# Altium schematic sheet 02-GPRS.SchDoc
size A4; DocumentNumber: 18; SheetNumber: 18; SheetTotal: 34
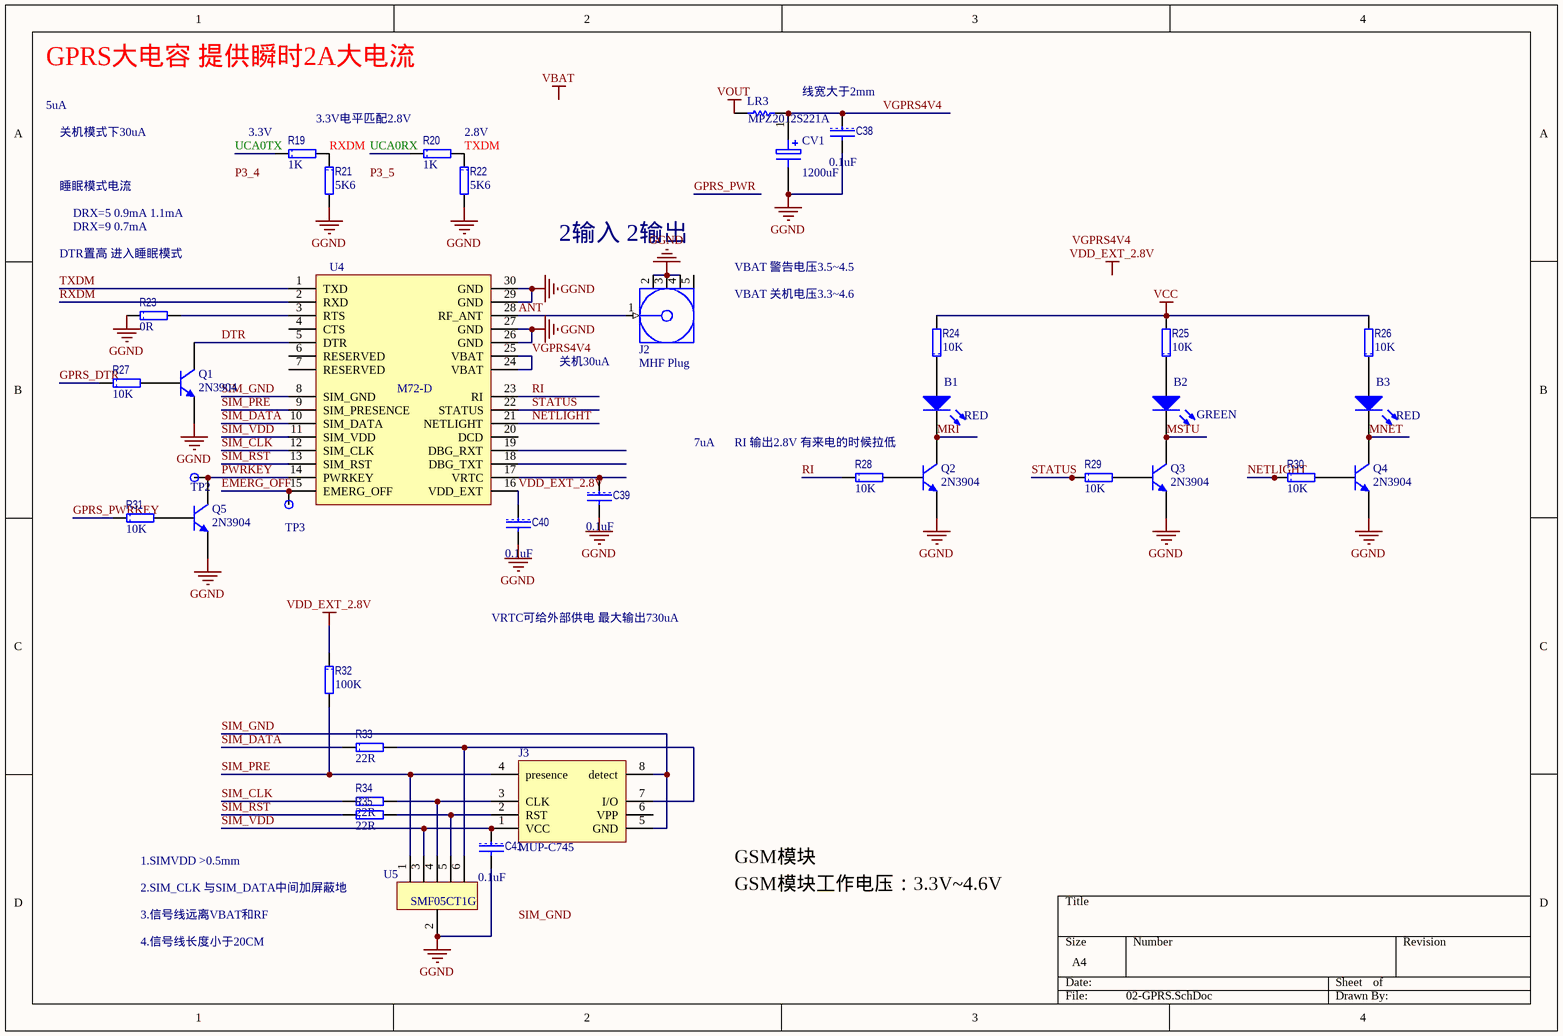
[diagram p0: 02-GPRS.SchDoc]

## Parts
B1  RED  [0805LED]
B2  GREEN  [0805LED]
B3  RED  [0805LED]
C38  value 0.1uF  [1608[0603]C]  (hidden comment: C1608X7R1H104K)
C39  value 0.1uF  [1608[0603]C]  (hidden comment: C1608X7R1H104K)
C40  value 0.1uF  [1608[0603]C]  (hidden comment: C1608X7R1H104K)
C41  value 0.1uF  [1608[0603]C]  (hidden comment: C1608X7R1H104K)
CV1  value 1200uF  [CAPPR5-10x20/H1.1]  (hidden comment: EEUFC1A122)
J2  MHF Plug  [MHF[MCB3]-V4]
J3  MUP-C745  [MUP-C745]
LR3  MPZ2012S221A  [2012[0805]]
Q1  2N3904  [SOT23_N]
Q2  2N3904  [SOT23_N]
Q3  2N3904  [SOT23_N]
Q4  2N3904  [SOT23_N]
Q5  2N3904  [SOT23_N]
R19  value 1K  [1608[0603]R]  (hidden comment: CRCW06031K00FKEA)
R20  value 1K  [1608[0603]R]  (hidden comment: CRCW06031K00FKEA)
R21  value 5K6  [1608[0603]R]  (hidden comment: CRCW060310K0FKEA)
R22  value 5K6  [1608[0603]R]  (hidden comment: CRCW060310K0FKEA)
R23  value 0R  [1608[0603]R]  (hidden comment: CRCW06030000ZSTA)
R24  value 10K  [1608[0603]R]  (hidden comment: CRCW060310K0FKEA)
R25  value 10K  [1608[0603]R]  (hidden comment: CRCW060310K0FKEA)
R26  value 10K  [1608[0603]R]  (hidden comment: CRCW060310K0FKEA)
R27  value 10K  [1608[0603]R]  (hidden comment: CRCW060310K0FKEA)
R28  value 10K  [1608[0603]R]  (hidden comment: CRCW060310K0FKEA)
R29  value 10K  [1608[0603]R]  (hidden comment: CRCW060310K0FKEA)
R30  value 10K  [1608[0603]R]  (hidden comment: CRCW060310K0FKEA)
R31  value 10K  [1608[0603]R]  (hidden comment: CRCW060310K0FKEA)
R32  value 100K  [1608[0603]R]  (hidden comment: CRCW0603100KFKEA)
R33  value 22R  [1608[0603]R]  (hidden comment: CRCW060322R0FKEA)
R34  value 22R  [1608[0603]R]  (hidden comment: CRCW060322R0FKEA)
R35  value 22R  [1608[0603]R]  (hidden comment: CRCW060322R0FKEA)
TP2  TP  [TP]  (value not drawn)
TP3  TP  [TP]  (value not drawn)
U4  M72-D  [M72D]
U5  SMF05CT1G  [SOT363-6N]

## Nets
GGND: C38.2 C39.2 C40.2 C41.2 CV1.2 J2.2(GND) J2.3(GND) J2.4(GND) Q1.1(E) Q2.1(E) Q3.1(E) Q4.1(E) Q5.1(E) R21.2 R22.2 R23.1 U4.26(GND) U4.27(GND) U4.29(GND) U4.30(GND) U5.2
VCC: R24.2 R25.2 R26.2
VDD_EXT_2.8V: C40.1 R32.1 U4.16(VDD_EXT)
VOUT: LR3.1
ANT: J2.1(Signal) U4.28(RF_ANT)
DTR: Q1.3(C) U4.5(DTR)
EMERG_OFF: TP3.1(TestPoint) U4.15(EMERG_OFF)
GPRS_DTR: R27.1
GPRS_PWRKEY: R31.1
MNET: B3.2(K) Q4.3(C)
MRI: B1.2(K) Q2.3(C)
MSTU: B2.2(K) Q3.3(C)
NETLIGHT: R30.1 U4.21(NETLIGHT)
PWRKEY: Q5.3(C) TP2.1(TestPoint) U4.14(PWRKEY)
RI: R28.1 U4.23(RI)
RXDM: R19.2 R21.1 U4.2(RXD)
SIM_CLK: R34.1 U4.12(SIM_CLK)
SIM_DATA: R33.1 U4.10(SIM_DATA)
SIM_GND: J3.5(GND) J3.8(detect) U4.8(SIM_GND)
SIM_PRE: J3.4(presence) R32.2 U4.9(SIM_PRESENCE) U5.1
SIM_RST: R35.1 U4.13(SIM_RST)
SIM_VDD: C41.1 J3.1(VCC) U4.11(SIM_VDD) U5.3
STATUS: R29.1 U4.22(STATUS)
TXDM: R20.2 R22.1 U4.1(TXD)
UCA0RX: R20.1
UCA0TX: R19.1
VGPRS4V4: C38.1 CV1.1 LR3.2 U4.24(VBAT) U4.25(VBAT)
NetB1_1: B1.1(A) R24.1
NetB2_1: B2.1(A) R25.1
NetB3_1: B3.1(A) R26.1
NetC39_1: C39.1 U4.17(VRTC)
NetJ3_2: J3.2(RST) R35.2 U5.5
NetJ3_3: J3.3(CLK) R34.2 U5.4
NetJ3_7: J3.7(I/O) R33.2 U5.6
NetQ1_2: Q1.2(B) R27.2
NetQ2_2: Q2.2(B) R28.2
NetQ3_2: Q3.2(B) R29.2
NetQ4_2: Q4.2(B) R30.2
NetQ5_2: Q5.2(B) R31.2
NetR23_2: R23.2 U4.3(RTS)

Not connected (* = marked no-connect by the designer): J2 5(GND); J3 6(VPP); U4 4(CTS) 6(RESERVED) 7(RESERVED) 18(DBG_TXT) 19(DBG_RXT) 20(DCD)

## Notes on the sheet
- 5uA
- GPRS大电容 提供瞬时2A大电流
- 线宽大于2mm
- 关机模式下30uA
- (near R19) 3.3V
- 3.3V电平匹配2.8V
- 2.8V
- 睡眠模式电流
- DRX=5 0.9mA 1.1mA
- DRX=9 0.7mA
- (near J2) 2输入 2输出
- DTR置高 进入睡眠模式
- (near J2) VBAT 警告电压3.5~4.5
- (near J2) VBAT 关机电压3.3~4.6
- 关机30uA
- 7uA
- (near R28) RI 输出2.8V 有来电的时候拉低
- VRTC可给外部供电 最大输出730uA
- 1.SIMVDD >0.5mm
- 2.SIM_CLK 与SIM_DATA中间加屏蔽地
- 3.信号线远离VBAT和RF
- GSM模块
- GSM模块工作电压：3.3V~4.6V
- 4.信号线长度小于20CM
- Labels drawn without touching a wire or pin: P3_4, P3_5, SIM_GND, VBAT, VDD_EXT_2.8V, VGPRS4V4

## Library data of the parts
B1-B3 = LED2: Typical RED, GREEN, YELLOW, AMBER GaAs LED; Published: 8-Jun-2000; LatestRevisionDate: 17-Jul-2002; LatestRevisionNote: Re-released for DXP Platform.; PackageVersion: Feb-2002; PackageReference: 3.2X1.6X1.1; Publisher: Altium Limited; PackageDescription: SM LED; 2 Flat Leads
C38-C41 = CAP: 多层陶瓷电容器MLCC - SMD/SMT 0603 0.1uF 50volts X7R 10%; Manufacturer: TDK; 产品: General Type MLCCs; 产品种类: Low & Medium Capacitance SMD Ceramic Chip Capacitors; 外壳代码 - in: 0603; 外壳代码 - mm: 1608; 封装 / 箱体: 0603 (1608 metric); 封装: Reel; 尺寸: 0.8 mm W x 1.6 mm L x 0.8 mm H; 工作温度范围: - 55 C to + 125 C; 标准包装数量: 4000; 电压额定值: 50 V; 电容-nF: 100 nF; 电容-pF: 100000 pF; 系列: C; Category: 多层陶瓷电容器MLCC - SMD/SMT; ComponentLink1Description: http://www.tdk.com/pdf/general_B11.pdf; ComponentLink1URL: http://www.tdk.com/pdf/general_B11.pdf; Description 1: 多层陶瓷电容器MLCC - SMD/SMT 0603 0.1uF 50volts X7R 10%; Manufacturer Part Number: C1608X7R1H104K; Minimum Order Quantity: 1; Pricing 1: 1=0.160, 50=0.070, 100=0.036, 500=0.019, 1000=0.013, 4000=0.010, 8000=0.009, 12000=0.008, 20000=0.007 (USD); Reeling: True; RoHS - 贸泽: Y; RoHS: RoHS Compliant; Stock 1: 224604; Supplier 1: Mouser; Supplier Part Number 1: 810-C1608X7R1H104K; 制造商: TDK; 容差: 10 %; 温度系数/代码: X7R; 电容: 0.1 uF; 端接类型: SMD/SMT
CV1 = ELECTRO1: 插针 铝质电解电容器 - 带引线 1200uF 10V; Manufacturer: Panasonic Electronic Components; Manufacturer Part Number: EEU-FC1A122; 工作温度范围: - 55 C to + 105 C; 封装: Bulk; 产品: High Temp Electrolytic Capacitors; 系列: FC; 端接类型: Radial; 容差: 20 %; 外壳直径: 10 mm; 外壳长度: 20 mm; 引线间隔: 5 mm; 制造商: Panasonic; 产品种类: Radial Electrolytic Aluminum Capacitors; 标准包装数量: 200; Supplier 1: Mouser; Supplier Part Number 1: 667-EEU-FC1A122; RoHS: RoHS Compliant; Description 1: 铝质电解电容器 - 带引线 1200uF 10V; Category: 铝质电解电容器 - 带引线; Stock 1: 1597; Pricing 1: 1=0.330, 25=0.300, 100=0.275, 250=0.254, 500=0.250, 1000=0.241, 2000=0.230, 5000=0.214 (USD); 电容: 1200 uF; 电压额定值: 10 V; RoHS - 贸泽: Y; Minimum Order Quantity: 1; Reeling: False; ComponentLink1URL: http://www.mouser.com/ds/2/315/ABA0000CE22-7179.pdf; ComponentLink1Description: http://www.mouser.com/ds/2/315/ABA0000CE22-7179.pdf
J2 = COAX-F: 插针 RF 连接器 ONBRD IPEX MHF RECEPTACLE; Manufacturer: Taoglas; Manufacturer Part Number: RECE-20279-001E-01; 触点电镀: Gold; 型式: Receptacle (Female); 方向: Right Angle; 封装: Reel; 产品: Connectors; 端接类型: SMD/SMT; 触点材料: Brass; 射频系列: U.FL; Product Status: New at Mouser; Supplier 1: Mouser; Supplier Part Number 1: 960-RECE20279001E01; RoHS: RoHS Compliant; Description 1: RF 连接器 ONBRD IPEX MHF RECEPTACLE; Category: RF 连接器; Stock 1: 8300; Pricing 1: 1=0.900, 50=0.869, 100=0.833, 250=0.810, 500=0.756, 1000=0.698, 5000=0.698 (USD); 制造商: Taoglas; RoHS - 贸泽: Y; Minimum Order Quantity: 1; Reeling: True; ComponentLink1URL: http://www.taoglas.com/images/product_images/original_images/RECE.20279.001E-%20IPEX%20MHFI%20(U.FL)%20Receptacle.pdf; ComponentLink1Description: http://www.taoglas.com/images/product_images/original_images/RECE.20279.001E-%20IPEX%20MHFI%20(U.FL)%20Receptacle.pdf
J3 = SIMCARD: CON; 公司: MUP
LR3 = Res Semi: 电磁干扰滤波珠子、扼流圈和阵列 Ferrite Chip Beads; Manufacturer: TDK; 阻抗: 220 Ohms; 最大直流电流: 3 A; 最大直流电阻: 0.04 Ohms; 工作温度范围: - 55 C to + 125 C; 封装 / 箱体: 2012; 封装: Reel; 端接类型: SMD/SMT; 容差: 25 %; 产品种类: Ferrite Beads; 标准包装数量: 4000; Supplier 1: Mouser; Supplier Part Number 1: 810-MPZ2012S221A; Manufacturer Part Number: MPZ2012S221A; RoHS: RoHS Compliant; Description 1: 电磁干扰滤波珠子、扼流圈和阵列 Ferrite Chip Beads; Category: 电磁干扰滤波珠子、扼流圈和阵列; Stock 1: 26540; Pricing 1: 1=0.070, 50=0.060, 100=0.053, 500=0.040, 1000=0.035, 4000=0.031, 8000=0.029, 12000=0.025 (USD); 制造商: TDK; RoHS - 贸泽: Y; Minimum Order Quantity: 1; Reeling: True; ComponentLink1URL: http://www.mouser.com/ds/2/400/e9413_mpz-24582.pdf; ComponentLink1Description: http://www.mouser.com/ds/2/400/e9413_mpz-24582.pdf
Q1-Q5 = 2N3904: NPN General Purpose Amplifier; Published: 8-Jun-2000; LatestRevisionDate: 15-Jan-2003; LatestRevisionNote: PCB Footprint 'BCY-W3/D4.7' replaced; DatasheetVersion: 1997; PackageVersion: Sep-1998; PackageReference: TO-92A; Publisher: Altium Limited; PackageDescription: TO, Flat Index; 3 In-Line, Axial Leads; Body Dia. 4.5mm; Leads 0.51 x 0.48 mm (max); ComponentLink1Description: Manufacturer Link; ComponentLink1URL: http://www.fairchildsemi.com/; ComponentLink2Description: Datasheet; ComponentLink2URL: http://www.fairchildsemi.com/ds/2N%2F2N3904.pdf
R19 R20 = RES: 厚膜电阻器 - SMD 1/10watt 1.0Kohms 1%; Manufacturer: Vishay / Dale; 尺寸: 0.85 mm W x 1.55 mm L x 0.45 mm H; 工作温度范围: - 55 C to + 155 C; 封装 / 箱体: 0603 (1608 metric); 封装: Reel; 功率额定值: 100 mW; 产品: Thick Film Resistors SMD; 电阻: 1 kOhms; 系列: CRCW; 温度系数: 100 PPM / K; 端接类型: SMD/SMT; 电压额定值: 75 V; 制造商: Vishay; 产品种类: 0603 Thick Film Chip Resistors; 标准包装数量: 5000; 外壳代码 - in: 0603; 外壳代码 - mm: 1608; Supplier 1: Mouser; Supplier Part Number 1: 71-CRCW0603-1.0K-E3; Manufacturer Part Number: CRCW06031K00FKEA; RoHS: RoHS Compliant By Exemption; Category: 厚膜电阻器 - SMD; Stock 1: 276938; Pricing 1: 1=0.080, 10=0.013, 100=0.010, 1000=0.008, 5000=0.005, 25000=0.004, 50000=0.003 (USD); 容差: 1 %; RoHS - 贸泽: E; Minimum Order Quantity: 1; Reeling: True; ComponentLink1URL: http://www.mouser.com/ds/2/427/dcrcwe3-109170.pdf; ComponentLink1Description: http://www.mouser.com/ds/2/427/dcrcwe3-109170.pdf; Description 1: 厚膜电阻器 - SMD 1/10watt 1.0Kohms 1%
R21 R22 R24-R31 = RES: 厚膜电阻器 - SMD 1/10watt 10Kohms 1%; Manufacturer: Vishay / Dale; 尺寸: 0.85 mm W x 1.55 mm L x 0.45 mm H; 工作温度范围: - 55 C to + 155 C; 封装 / 箱体: 0603 (1608 metric); 封装: Reel; 功率额定值: 100 mW; 产品: Thick Film Resistors SMD; 系列: CRCW; 温度系数: 100 PPM / K; 端接类型: SMD/SMT; 电压额定值: 75 V; 制造商: Vishay; 产品种类: 0603 Thick Film Chip Resistors; 标准包装数量: 5000; 外壳代码 - in: 0603; 外壳代码 - mm: 1608; Supplier 1: Mouser; Supplier Part Number 1: 71-CRCW0603-10K-E3; Manufacturer Part Number: CRCW060310K0FKEA; RoHS: RoHS Compliant By Exemption; Category: 厚膜电阻器 - SMD; Stock 1: 0; Pricing 1: 1=0.080, 10=0.013, 100=0.010, 1000=0.008, 5000=0.005, 25000=0.004, 50000=0.003 (USD); 电阻: 10 kOhms; 容差: 1 %; RoHS - 贸泽: E; Minimum Order Quantity: 1; Reeling: True; ComponentLink1URL: http://www.mouser.com/ds/2/427/dcrcwe3-109170.pdf; ComponentLink1Description: http://www.mouser.com/ds/2/427/dcrcwe3-109170.pdf; Description 1: 厚膜电阻器 - SMD 1/10watt 10Kohms 1%
R23 = RES: 厚膜电阻器 - SMD 1/10watt ZEROohm Jumper; Manufacturer: Vishay / Dale; 尺寸: 0.85 mm W x 1.55 mm L x 0.45 mm H; 工作温度范围: - 55 C to + 155 C; 封装 / 箱体: 0603 (1608 metric); 封装: Reel; 功率额定值: 100 mW; 产品: Thick Film Resistors Zero-Ohm; 电阻: 0 Ohms; 系列: CRCW; 温度系数: 200 PPM / C; 端接类型: SMD/SMT; 容差: 1 %; 电压额定值: 75 V; 外壳代码 - in: 0603; 外壳代码 - mm: 1608; 制造商: Vishay; 产品种类: 0603 Thick Film Chip Resistors; 标准包装数量: 5000; Supplier 1: Mouser; Supplier Part Number 1: 71-CRCW0603-0; Manufacturer Part Number: CRCW06030000ZSTA; RoHS: No; Category: 厚膜电阻器 - SMD; Stock 1: 44945; Pricing 1: 1=0.110, 10=0.064, 100=0.036, 1000=0.024, 5000=0.010, 10000=0.009, 25000=0.008, 50000=0.006 (USD); RoHS - 贸泽: N; Minimum Order Quantity: 1; Reeling: True; ComponentLink1URL: http://www.mouser.com/ds/2/427/dcrcw-72725.pdf; ComponentLink1Description: http://www.mouser.com/ds/2/427/dcrcw-72725.pdf; Description 1: 厚膜电阻器 - SMD 1/10watt ZEROohm Jumper
R32 = RES: 厚膜电阻器 - SMD 1/10watt 100Kohms 1%; Manufacturer: Vishay / Dale; 尺寸: 0.85 mm W x 1.55 mm L x 0.45 mm H; 工作温度范围: - 55 C to + 155 C; 封装 / 箱体: 0603 (1608 metric); 封装: Reel; 功率额定值: 100 mW; 产品: Thick Film Resistors SMD; 系列: CRCW; 温度系数: 100 PPM / K; 端接类型: SMD/SMT; 电压额定值: 75 V; 制造商: Vishay; 产品种类: 0603 Thick Film Chip Resistors; 标准包装数量: 5000; 外壳代码 - in: 0603; 外壳代码 - mm: 1608; Supplier 1: Mouser; Supplier Part Number 1: 71-CRCW0603-100K-E3; Manufacturer Part Number: CRCW0603100KFKEA; RoHS: RoHS Compliant By Exemption; Category: 厚膜电阻器 - SMD; Stock 1: 175756; Pricing 1: 1=0.080, 10=0.013, 100=0.010, 1000=0.008, 5000=0.005, 25000=0.004, 50000=0.003 (USD); 电阻: 100 kOhms; 容差: 1 %; RoHS - 贸泽: E; Minimum Order Quantity: 1; Reeling: True; ComponentLink1URL: http://www.mouser.com/ds/2/427/dcrcwe3-109170.pdf; ComponentLink1Description: http://www.mouser.com/ds/2/427/dcrcwe3-109170.pdf; Description 1: 厚膜电阻器 - SMD 1/10watt 100Kohms 1%
R33-R35 = RES: 厚膜电阻器 - SMD 1/10watt 22ohms 1%; Manufacturer: Vishay / Dale; 尺寸: 0.85 mm W x 1.55 mm L x 0.45 mm H; 工作温度范围: - 55 C to + 155 C; 封装 / 箱体: 0603 (1608 metric); 封装: Reel; 功率额定值: 100 mW; 产品: Thick Film Resistors SMD; 系列: CRCW; 温度系数: 100 PPM / K; 端接类型: SMD/SMT; 电压额定值: 75 V; 制造商: Vishay; 标准包装数量: 5000; 外壳代码 - in: 0603; 外壳代码 - mm: 1608; 产品种类: 0603 Thick Film Chip Resistors; Supplier 1: Mouser; Supplier Part Number 1: 71-CRCW0603-22-E3; Manufacturer Part Number: CRCW060322R0FKEA; RoHS: RoHS Compliant By Exemption; Category: 厚膜电阻器 - SMD; Stock 1: 35802; 电阻: 22 Ohms; 容差: 1 %; Minimum Order Quantity: 1; Reeling: True; ComponentLink1URL: http://www.mouser.com/ds/2/427/dcrcwe3-109170.pdf; ComponentLink1Description: http://www.mouser.com/ds/2/427/dcrcwe3-109170.pdf; Description 1: 厚膜电阻器 - SMD 1/10watt 22ohms 1%; Pricing 1: 1=0.080, 10=0.013, 100=0.010, 1000=0.008, 5000=0.005, 25000=0.004, 50000=0.003 (USD); RoHS - 贸泽: E
TP2 TP3 = Test Point
U4 = M72-D: GSM模块; 公司: 上海移远
U5 = SMF05CT1G: TVS二极管阵列 5 Line TVS Array; Manufacturer: ON Semiconductor; 击穿电压: 6.2 V; 电容: 80 pF; 钳位电压: 12.5 V; 尺寸: 1.25 mm W x 2 mm L; 工作电压: 5 V; 封装 / 箱体: SC-70-6; 封装: Reel; 系列: SMFxxCT1G; 端接类型: SMD/SMT; 通道: 5 Channels; 峰值浪涌电流: 8 A; 最大工作温度: + 125 C; 最小工作温度: - 40 C; 峰值脉冲功率耗散: 100 W; 极性: Unidirectional; 产品种类: Diodes- Zener; 标准包装数量: 3000; Supplier 1: Mouser; Supplier Part Number 1: 863-SMF05CT1G; Manufacturer Part Number: SMF05CT1G; RoHS: RoHS Compliant; Description 1: TVS二极管阵列 5 Line TVS Array; Category: TVS二极管阵列; Stock 1: 6019; Pricing 1: 1=0.330, 25=0.285, 100=0.187, 500=0.155, 1000=0.116, 2000=0.107, 3000=0.107, 5000=0.100, 10000=0.093, 25000=0.086 (USD); 安装风格: SMD/SMT; 制造商: ON Semiconductor; RoHS - 贸泽: Y; Minimum Order Quantity: 1; Reeling: True; ComponentLink1URL: http://www.mouser.com/ds/2/308/SMF05C-D-100912.pdf; ComponentLink1Description: http://www.mouser.com/ds/2/308/SMF05C-D-100912.pdf